# Altium schematic sheet [02] - BLOCK DIAGRAM.SchDoc
size A4; DocumentNumber: 2; SheetNumber: 2; SheetTotal: 9
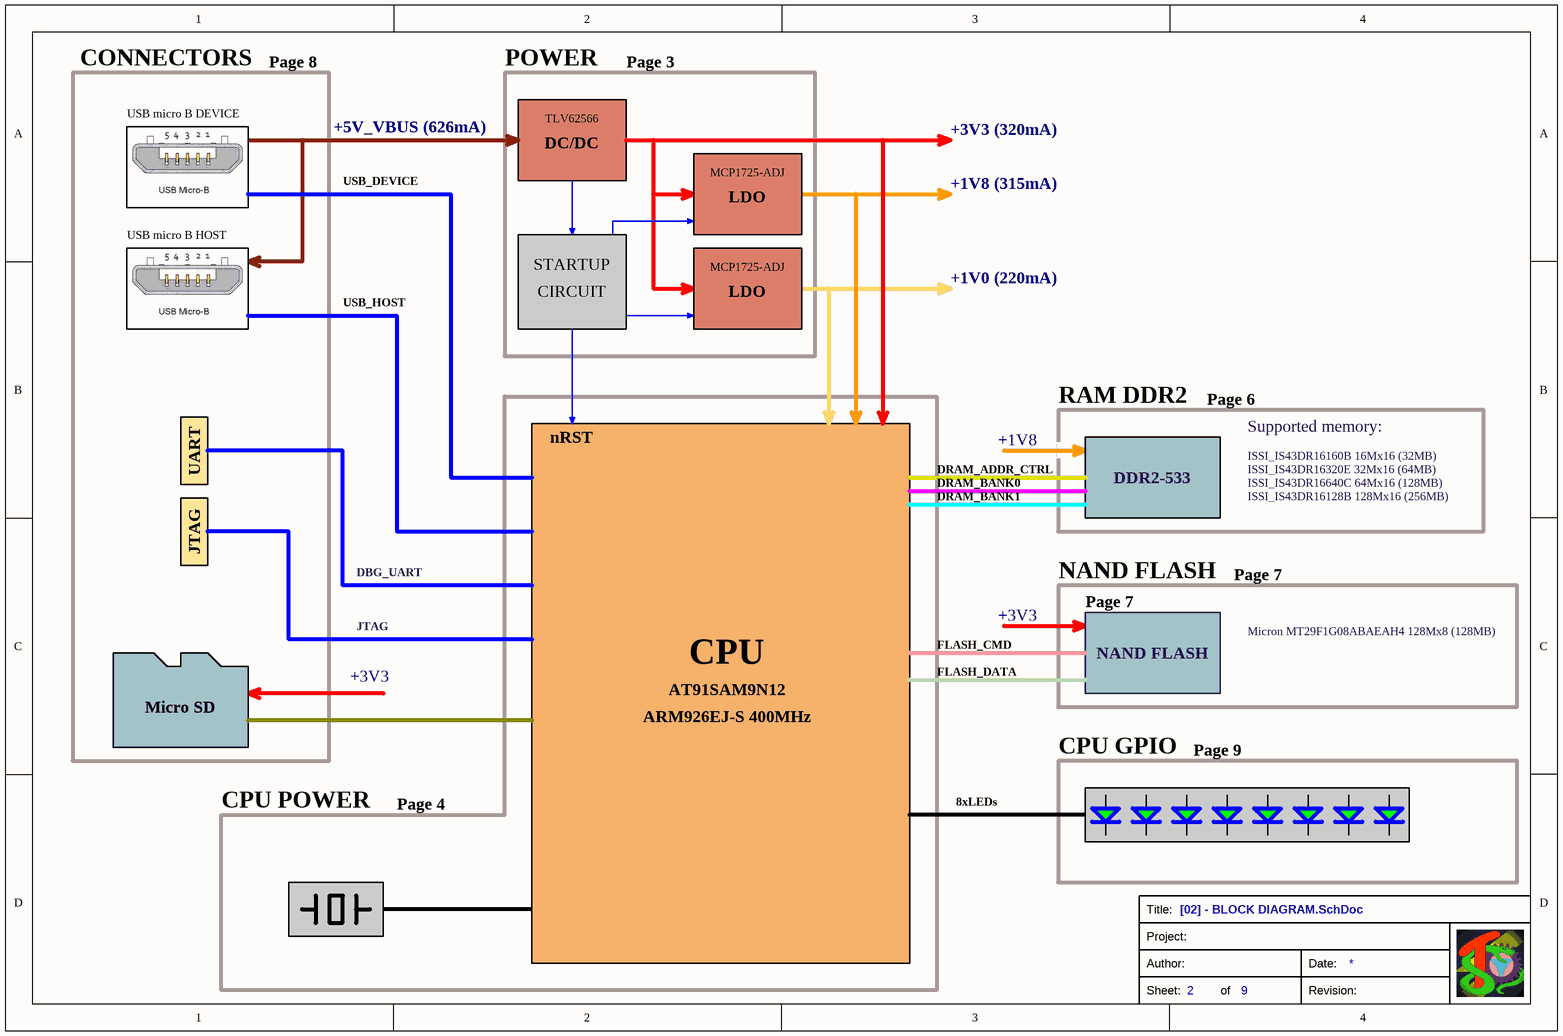
[diagram p0: [02] - BLOCK DIAGRAM.SchDoc]

## Notes on the sheet
- CONNECTORS
- USB micro B DEVICE
- Page 8
- POWER
- Page 3
- USB_DEVICE
- +5V_VBUS (626mA)
- TLV62566
- DC/DC
- MCP1725-ADJ
- +3V3 (320mA)
- USB micro B HOST
- LDO
- +1V8 (315mA)
- USB_HOST
- STARTUP
- CIRCUIT
- +1V0 (220mA)
- UART
- nRST
- +1V8
- PMIC 1
- RAM DDR2
- Page 6
- Supported memory:
- DRAM_ADDR_CTRL
- DRAM_BANK0
- DRAM_BANK1
- DDR2-533
- ISSI_IS43DR16160B 16Mx16 (32MB)
- ISSI_IS43DR16320E 32Mx16 (64MB)
- ISSI_IS43DR16640C 64Mx16 (128MB)
- ISSI_IS43DR16128B 128Mx16 (256MB)
- JTAG
- DBG_UART
- NAND FLASH
- Page 7
- FLASH_CMD
- +3V3
- Micron MT29F1G08ABAEAH4 128Mx8 (128MB)
- Micro SD
- AT91SAM9N12
- CPU
- FLASH_DATA
- ARM926EJ-S 400MHz
- CPU GPIO
- Page 9
- CPU POWER
- Page 4
- 8xLEDs
- Title:
- Project:
- Sheet:
- Author:
- of
- Revision:
- Date: